# Altium schematic sheet Upconversion.SchDoc: Phaser
size 420 x 297 mm; Author: G.Kasprowicz; CompanyName: WUT ISE; DrawnBy: G.Kasprowicz; Organization: WUT ISE; Address1: PW ISE; Address2: Nowowiejska 15/19 00-665 Warsaw; Address3: gkasprow@gmail.com; DocumentNumber: 9; Revision: 2; SheetNumber: 9; SheetTotal: 18; ModifiedBy: -; CheckedDate: -; Title2: Upconverter; DivGrp: WUT ISE; Designer: G.Kasprowicz; ModifiedDate: -; ProjectName: Sensor Box
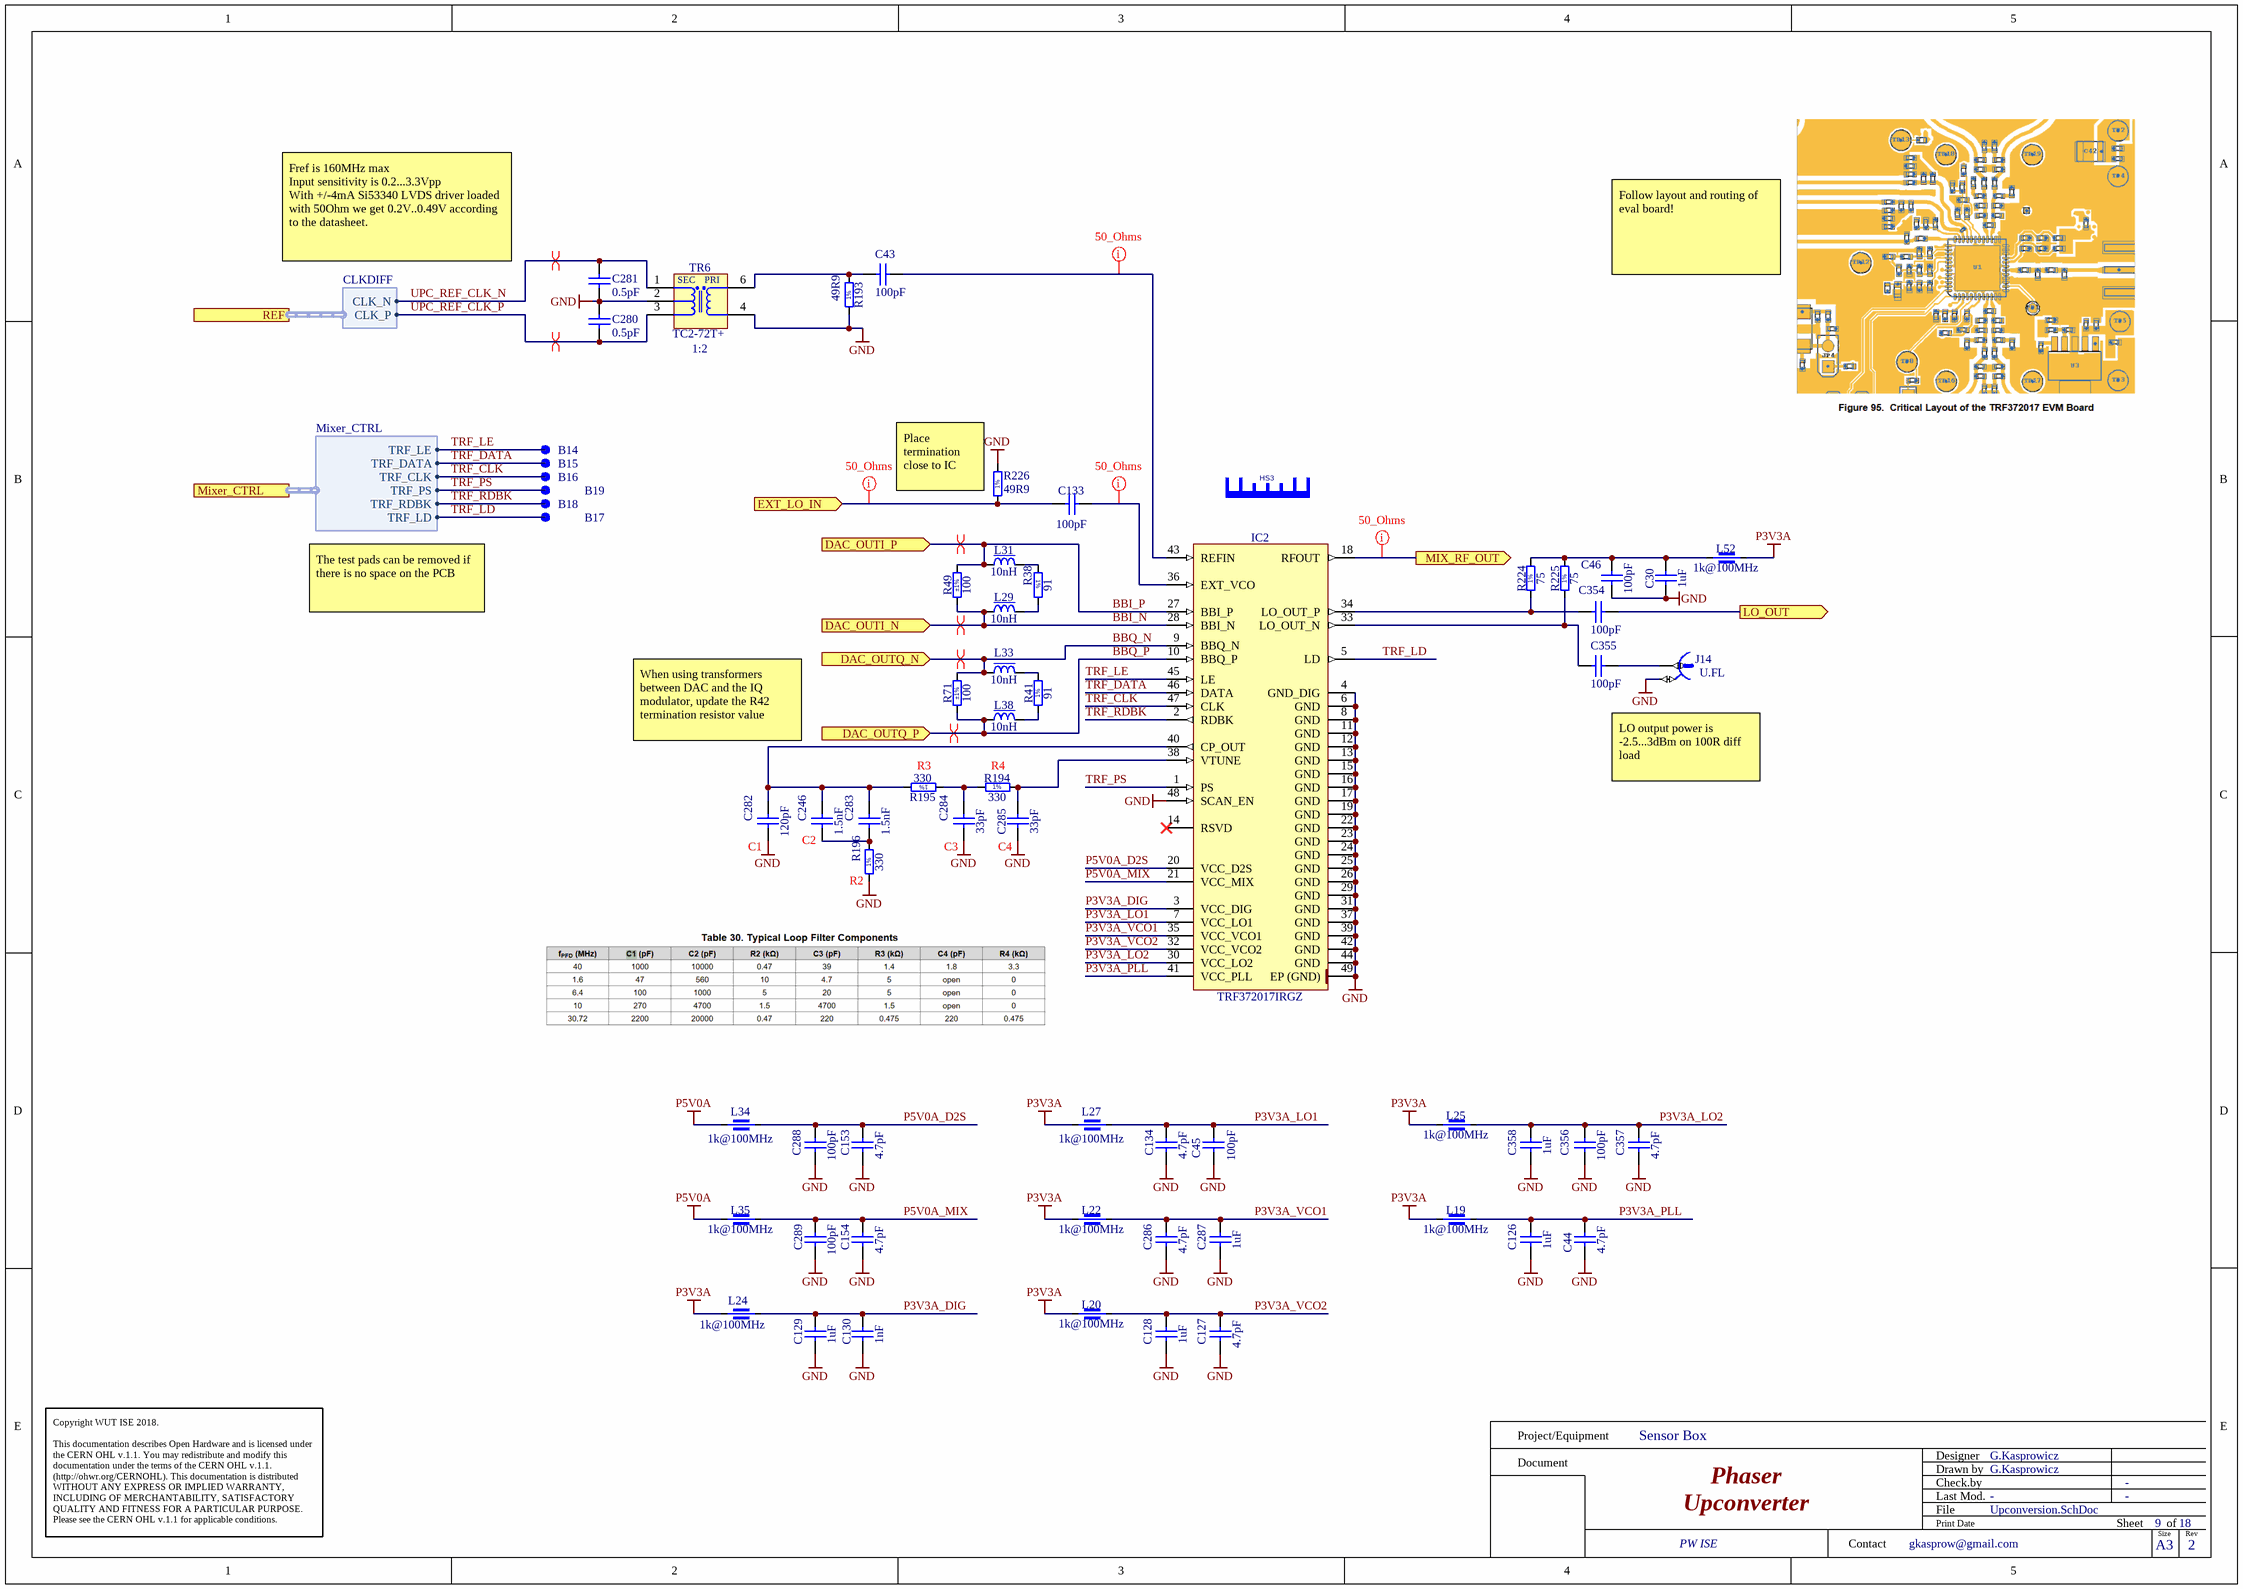
[diagram p0: Upconversion.SchDoc]

## Parts
B14  SMD Pad  [C100]  (value not drawn)
B15  SMD Pad  [C100]  (value not drawn)
B16  SMD Pad  [C100]  (value not drawn)
B17  SMD Pad  [C100]  (value not drawn)
B18  SMD Pad  [C100]  (value not drawn)
B19  SMD Pad  [C100]  (value not drawn)
C30  1uF  [CAPC1005X55N]
C43  100pF  [CAPC1005X55N]
C44  4.7pF  [CAPC1005X55N]
C45  100pF  [CAPC1005X55N]
C46  100pF  [CAPC1005X55N]
C126  1uF  [CAPC1005X55N]
C127  4.7pF  [CAPC1005X55N]
C128  1uF  [CAPC1005X55N]
C129  1uF  [CAPC1005X55N]
C130  1nF  [CAPC1005X55N]
C133  100pF  [CAPC1005X55N]
C134  4.7pF  [CAPC1005X55N]
C153  4.7pF  [CAPC1005X55N]
C154  4.7pF  [CAPC1005X55N]
C246  1.5nF  [CAPC1608X87N]
C280  0.5pF  [CAPC1005X50N]
C281  0.5pF  [CAPC1005X50N]
C282  120pF  [CAPC1608X87N]
C283  1.5nF  [CAPC1608X87N]
C284  33pF  [CAPC2012X135N]
C285  33pF  [CAPC2012X135N]
C286  4.7pF  [CAPC1005X55N]
C287  1uF  [CAPC1005X55N]
C288  100pF  [CAPC1005X55N]
C289  100pF  [CAPC1005X55N]
C354  100pF  [CAPC1005X55N]
C355  100pF  [CAPC1005X55N]
C356  100pF  [CAPC1005X55N]
C357  4.7pF  [CAPC1005X55N]
C358  1uF  [CAPC1005X55N]
HS3  Heat Sink No Pad  [HSINK_17156]  (value not drawn)
IC2  TRF372017IRGZ  [QFN50P700X700X100-49N-S560]
J14  U.FL  [HIROSE_U.FL-R-SMT-1(10)]
L19  1k@100MHz  [INDC1005X55N]
L20  1k@100MHz  [INDC1005X55N]
L22  1k@100MHz  [INDC1005X55N]
L24  1k@100MHz  [INDC1005X55N]
L25  1k@100MHz  [INDC1005X55N]
L27  1k@100MHz  [INDC1005X55N]
L29  10nH  [IND_COILCRAFT_0402DC]
L31  10nH  [IND_COILCRAFT_0402DC]
L33  10nH  [IND_COILCRAFT_0402DC]
L34  1k@100MHz  [INDC1005X55N]
L35  1k@100MHz  [INDC1005X55N]
L38  10nH  [IND_COILCRAFT_0402DC]
L52  1k@100MHz  [INDC1005X55N]
R38  91  [RESC1005X40N]
R41  91  [RESC1005X40N]
R49  100  Tolerance: ±1%  [RESC1005X40N]
R71  100  Tolerance: ±1%  [RESC1005X40N]
R193  49R9  [RESC1005X40N]
R194  330  [RESC1608X55N]
R195  330  [RESC1608X55N]
R196  330  [RESC1608X55N]
R224  75  [RESC1005X40N]
R225  75  [RESC1005X40N]
R226  49R9  [RESC1005X40N]
TR6  1:2  Manufacturer Part Number: TC2-72T+  [XFMR_MINI-CIRCUITS_AT1521]

## Ports
DAC_OUTI_N (in), DAC_OUTI_P (in), DAC_OUTQ_N (in), DAC_OUTQ_P (in), EXT_LO_IN (in), LO_OUT (out), MIX_RF_OUT (out), Mixer_CTRL (harness Mixer_CTRL), REF (harness CLKDIFF)

## Harnesses
CLKDIFF: CLK_N, CLK_P
Mixer_CTRL: TRF_LE, TRF_DATA, TRF_CLK, TRF_PS, TRF_RDBK, TRF_LD

## Nets
GND: C30.1 C44.1 C45.1 C46.1 C126.1 C127.1 C128.1 C129.1 C130.1 C134.1 C153.1 C154.1 C280.1 C281.2 C282.1 C284.1 C285.1 C286.1 C287.1 C288.1 C289.1 C356.1 C357.1 C358.1 IC2.4(GND_DIG) IC2.6(GND) IC2.8(GND) IC2.11(GND) IC2.12(GND) IC2.13(GND) IC2.15(GND) IC2.16(GND) IC2.17(GND) IC2.19(GND) IC2.22(GND) IC2.23(GND) IC2.24(GND) IC2.25(GND) IC2.26(GND) IC2.29(GND) IC2.31(GND) IC2.37(GND) IC2.39(GND) IC2.42(GND) IC2.44(GND) IC2.48(SCAN_EN) IC2.49(EP_(GND)) J14.2 R193.1 R196.1 R226.2 TR6.2(NC) TR6.4(P)
P3V3A: L19.2 L20.2 L22.2 L24.2 L25.2 L27.1 L52.2
P5V0A: L34.1 L35.2
BBI_N: IC2.28(BBI_N) L29.1 R49.1 ; port DAC_OUTI_N
BBI_P: IC2.27(BBI_P) L31.1 R49.2 ; port DAC_OUTI_P
BBQ_N: IC2.9(BBQ_N) L33.1 R71.2 ; port DAC_OUTQ_N
BBQ_P: IC2.10(BBQ_P) L38.1 R71.1 ; port DAC_OUTQ_P
EXT_LO_IN: C133.1 R226.1 ; port EXT_LO_IN
LO_OUT: C354.1 ; port LO_OUT
MIX_RF_OUT: IC2.18(RFOUT) ; port MIX_RF_OUT
P3V3A_DIG: C129.2 C130.2 IC2.3(VCC_DIG) L24.1
P3V3A_LO1: C45.2 C134.2 IC2.7(VCC_LO1) L27.2
P3V3A_LO2: C356.2 C357.2 C358.2 IC2.30(VCC_LO2) L25.1
P3V3A_PLL: C44.2 C126.2 IC2.41(VCC_PLL) L19.1
P3V3A_VCO1: C286.2 C287.2 IC2.35(VCC_VCO1) L22.1
P3V3A_VCO2: C127.2 C128.2 IC2.32(VCC_VCO2) L20.1
P5V0A_D2S: C153.2 C288.2 IC2.20(VCC_D2S) L34.2
P5V0A_MIX: C154.2 C289.2 IC2.21(VCC_MIX) L35.1
TRF_CLK: B16.1 IC2.47(CLK) ; port Mixer_CTRL.TRF_CLK
TRF_DATA: B15.1 IC2.46(DATA) ; port Mixer_CTRL.TRF_DATA
TRF_LD: B17.1 IC2.5(LD) ; port Mixer_CTRL.TRF_LD
TRF_LE: B14.1 IC2.45(LE) ; port Mixer_CTRL.TRF_LE
TRF_PS: B19.1 IC2.1(PS) ; port Mixer_CTRL.TRF_PS
TRF_RDBK: B18.1 IC2.2(RDBK) ; port Mixer_CTRL.TRF_RDBK
UPC_REF_CLK_N: C281.1 TR6.1(SDOT) ; port REF.CLK_N
UPC_REF_CLK_P: C280.2 TR6.3(S) ; port REF.CLK_P
NetC30_2: C30.2 C46.2 L52.1 R224.2 R225.2
NetC43_1: C43.1 R193.2 TR6.6(PDOT)
NetC43_2: C43.2 IC2.43(REFIN)
NetC133_2: C133.2 IC2.36(EXT_VCO)
NetC246_1: C246.1 C283.1 R196.2
NetC246_2: C246.2 C282.2 C283.2 IC2.40(CP_OUT) R195.2
NetC284_2: C284.2 R194.1 R195.1
NetC285_2: C285.2 IC2.38(VTUNE) R194.2
NetC354_2: C354.2 IC2.34(LO_OUT_P) R224.1
NetC355_1: C355.1 J14.1
NetC355_2: C355.2 IC2.33(LO_OUT_N) R225.1
NetL29_2: L29.2 R38.2
NetL31_2: L31.2 R38.1
NetL33_2: L33.2 R41.2
NetL38_2: L38.2 R41.1

Not connected (* = marked no-connect by the designer): IC2 14(RSVD)*

## Layout directives
differential pair; differential pair class Diff_100Ohm: BBI_N, BBI_P, BBQ_N, BBQ_P, UPC_REF_CLK_N, UPC_REF_CLK_P
net class 50_Ohms: EXT_LO_IN, MIX_RF_OUT, NetC43_2, NetC133_2

## Notes on the sheet
- Fref is 160MHz max
  Input sensitivity is 0.2...3.3Vpp
  With +/-4mA Si53340 LVDS driver loaded with 50Ohm we get 0.2V..0.49V according to the datasheet.
- Follow layout and routing of eval board!
- (near R226) Place termination close to IC
- The test pads can be removed if there is no space on the PCB
- When using transformers between DAC and the IQ modulator, update the R42 termination resistor value
- (near R195) R3
- (near R194) R4
- LO output power is -2.5...3dBm on 100R diff load
- (near C282) C1
- (near C246) C2
- (near C284) C3
- (near C285) C4
- (near R196) R2
- Project/Equipment
- Document
- Designer
- Drawn by
- Check.by
- Copyright WUT ISE 2018.
  This documentation describes Open Hardware and is licensed under the CERN OHL v.1.1. You may redistribute and modify this documentation under the terms of the CERN OHL v.1.1. (http://ohwr.org/CERNOHL). This documentation is distributed WITHOUT ANY EXPRESS OR IMPLIED WARRANTY, INCLUDING OF MERCHANTABILITY, SATISFACTORY QUALITY AND FITNESS FOR A PARTICULAR PURPOSE. Please see the CERN OHL v.1.1 for applicable conditions.
- Contact
- File
- Last Mod.
- Print Date
- Sheet
- Size
- A3
- of
- Rev
- (in symbol R0402_49R9_1%_0.0625W_100PPM) 1%
- (in symbol R0402_75R_1%_0.0625W_100PPM) 1%
- (in symbol R0402_91R_1%_0.0625W_100PPM) 1%
- (in symbol R0603_330R_1%_0.1W_100PPM) 1%
- (in symbol XFMR_MINI-CIRCUITS_TC2-72T+) SEC; PRI

## Library data of the parts
B14-B19 = SMD_PAD_D1MM: Through Hole Pad; Part Description: 1mm Diameter SMD Pad; Mounted: No; Part Number: SMD_PAD_D1MM; Component Kind: Standard (No BOM); Component Type: Standard (No BOM); Pin Count: 1; Family: SMD Pad; Socket: No; SMD: No; Sense: No; Status: None; ComponentHeight: 0mm; HelpURL: Undefined; Author: CERN DEM JLC; CreateDate: 10.10.2017; LatestRevisionDate: 10.10.2017; PackageDescription: 1mm Diameter SMD Pad
C30 C126 C128 C129 C287 C358 = CC0402_1UF_16V_10%_X5R: Non-polarised capacitor; Part Description: SMD Multilayer Chip Ceramic Capacitor; Manufacturer: GENERIC; Manufacturer1 Part Number: C1005X5R1C105KT; Voltage: 16V; TC: X5R; Tolerance: ±10%; Part Number: CC0402_1UF_16V_10%_X5R; Component Kind: Standard; Component Type: Standard; Pin Count: 2; Value: 1uF; Status: Preferred; Manufacturer Part Number: CC0402_1UF_16V_10%_X5R; Case: 0402; Mounted: Yes; Socket: No; SMD: Yes; Sense: No; Manufacturer1 Example: TDK; Manufacturer1 ComponentHeight: 0.55mm; HelpURL: \\cern.ch\dfs\Applications\Altium\Datasheets\CC0402_X5R_TDK_C.pdf; Author: CERN DEM JLC; CreateDate: 25.10.2012; LatestRevisionDate: 25.10.2012
C43 C45 C46 C133 C288 C289 C354-C356 = CC0402_100PF_50V_5%_C0G: Non-polarised capacitor; Part Description: SMD Multilayer Chip Ceramic Capacitor; Manufacturer: GENERIC; Manufacturer1 Part Number: C0402C101J5GACTU; Voltage: 50V; TC: C0G/NP0; Tolerance: ±5%; Part Number: CC0402_100PF_50V_5%_C0G; Component Kind: Standard; Component Type: Standard; Pin Count: 2; Value: 100pF; Status: Preferred; Manufacturer Part Number: CC0402_100PF_50V_5%_C0G; Case: 0402; Mounted: Yes; Socket: No; SMD: Yes; Sense: No; Manufacturer1 Example: KEMET; Manufacturer1 ComponentHeight: 0.55mm; HelpURL: \\cern.ch\dfs\Applications\Altium\Datasheets\CC0805_C0G_KEMET_(Commercial Grade).pdf; Author: CERN DEM JLC
  C43 C45 C46 C288 C289 C354-C356: CreateDate: 2007-12-03; LatestRevisionDate: 2015-04-22
  C133: CreateDate: 03.12.2007; LatestRevisionDate: 22.04.2015
C44 C127 C134 C153 C154 C286 C357 = CC0402_4.7PF_50V_0.25PF_C0G: Non-polarised capacitor; Part Description: SMD Multilayer Chip Ceramic Capacitor; Manufacturer: GENERIC; Manufacturer1 Part Number: C0402C479C5GACTU; Voltage: 50V; TC: C0G/NP0; Tolerance: ±0.25pF; Part Number: CC0402_4.7PF_50V_0.25PF_C0G; Component Kind: Standard; Component Type: Standard; Pin Count: 2; Value: 4.7pF; Status: Preferred; Manufacturer Part Number: CC0402_4.7PF_50V_0.25PF_C0G; Case: 0402; Mounted: Yes; Socket: No; SMD: Yes; Sense: No; Manufacturer1 Example: KEMET; Manufacturer1 ComponentHeight: 0.55mm; HelpURL: \\cern.ch\dfs\Applications\Altium\Datasheets\CC0805_C0G_KEMET_(Commercial Grade).pdf; Author: CERN DEM JLC; CreateDate: 03.12.2007; LatestRevisionDate: 22.04.2015
C130 = CC0402_1NF_50V_10%_X7R: Non-polarised capacitor; Part Description: SMD Multilayer Chip Ceramic Capacitor; Manufacturer: GENERIC; Manufacturer1 Part Number: 223858715623; Voltage: 50V; TC: X7R; Tolerance: ±10%; Part Number: CC0402_1NF_50V_10%_X7R; Component Kind: Standard; Component Type: Standard; Pin Count: 2; Value: 1nF; Status: Not Recommended; Manufacturer Part Number: CC0402_1NF_50V_10%_X7R; Case: 0402; Mounted: Yes; Socket: No; SMD: Yes; Sense: No; Manufacturer1 Example: PHYCOMP; Manufacturer1 ComponentHeight: 0.55mm; HelpURL: \\cern.ch\dfs\Applications\Altium\Datasheets\CC0402_X7R_PHYCOMP.pdf; Author: CERN DEM JLC; CreateDate: 03.12.2007; LatestRevisionDate: 03.12.2007
C246 C283 = CC0603_1.5NF_50V_5%_NP0: Non-polarised capacitor; Part Description: SMD Multilayer Chip Ceramic Capacitor; Manufacturer: GENERIC; Manufacturer1 Part Number: GRM1885C1H152JA01D; Voltage: 50V; TC: C0G/NP0; Tolerance: ±5%; Part Number: CC0603_1.5NF_50V_5%_NP0; Component Kind: Standard; Component Type: Standard; Pin Count: 2; Value: 1.5nF; Status: None; Manufacturer Part Number: CC0603_1.5NF_50V_5%_NP0; Case: 0603; Mounted: Yes; Socket: No; SMD: Yes; Sense: No; Manufacturer1 Example: MURATA; Manufacturer1 ComponentHeight: 0.9mm; HelpURL: \\cern.ch\dfs\Applications\Altium\Datasheets\CC0603_NP0_MURATA.pdf; Author: CERN DEM JLC; CreateDate: 08.02.2011; LatestRevisionDate: 08.02.2011
C280 C281 = CC0402_0.5PF_25V_0.05PF_AVX_04023J0R5ABSTR: Non-polarised capacitor; Part Description: Thin-Film Chip Capacitors for RF Signal and Power Applications, Accu-P Series; Manufacturer: AVX; Voltage: 25V; Tolerance: ±0.05pF; Part Number: CC0402_0.5PF_25V_0.05PF_AVX_04023J0R5ABSTR; Component Kind: Standard; Component Type: Standard; Pin Count: 2; Value: 0.5pF; Status: None; Manufacturer Part Number: 04023J0R5ABSTR; Case: 0402; Mounted: Yes; Socket: No; SMD: Yes; Sense: No; ComponentHeight: 0.5mm; HelpURL: \\cern.ch\dfs\Applications\Altium\Datasheets\CC0402_AVX_ACCU-P.pdf; Author: CERN DEM JLC; CreateDate: 2017-02-22; LatestRevisionDate: 2017-02-22
C282 = CC0603_120PF_50V_5%_NP0: Non-polarised capacitor; Part Description: SMD Multilayer Chip Ceramic Capacitor; Manufacturer: GENERIC; Manufacturer1 Part Number: 223886715121; Voltage: 50V; TC: C0G/NP0; Tolerance: ±5%; Part Number: CC0603_120PF_50V_5%_NP0; Component Kind: Standard; Component Type: Standard; Pin Count: 2; Value: 120pF; Status: Preferred; Manufacturer Part Number: CC0603_120PF_50V_5%_NP0; Case: 0603; Mounted: Yes; Socket: No; SMD: Yes; Sense: No; Manufacturer1 Example: PHYCOMP; Manufacturer1 ComponentHeight: 0.87mm; HelpURL: \\cern.ch\dfs\Applications\Altium\Datasheets\CC0603_NP0_PHYCOMP.pdf; Author: CERN DEM JLC; CreateDate: 03.12.2007; LatestRevisionDate: 03.12.2007
C284 C285 = CC0805_33pF_50V_5%_NP0: Non-polarised capacitor; Part Description: SMD Multilayer Chip Ceramic Capacitor; Manufacturer: GENERIC; Manufacturer1 Part Number: 223886115339; Voltage: 50V; TC: C0G/NP0; Tolerance: ±5%; Part Number: CC0805_33PF_50V_5%_NP0; Component Kind: Standard; Component Type: Standard; Pin Count: 2; Value: 33pF; Status: Preferred; Manufacturer Part Number: CC0805_33PF_50V_5%_NP0; Case: 0805; Mounted: Yes; Socket: No; SMD: Yes; Sense: No; Manufacturer1 Example: PHYCOMP; Manufacturer1 ComponentHeight: 1.35mm; HelpURL: \\cern.ch\dfs\Applications\Altium\Datasheets\CC0805_NP0_PHYCOMP.pdf; Author: CERN DEM JLC; CreateDate: 03.12.2007; LatestRevisionDate: 03.12.2007
HS3 = HEAT_SINK_IC_7x7x15: Alphacool GPU RAM Aluminium Heatsinks 7x7mm - black; Part Number: 4250197171564; Manufacturer Part Number: 17156; PressFit: No; Component Kind: Accessories; Component Type: Standard; Pin Count: 0; PackageDescription: Alphacool GPU RAM Aluminium Heatsinks 7x7mm - black; Mounted: Yes; Socket: No; SMD: No; Sense: No; Status: None; Part Description: Alphacool GPU RAM Aluminium Heatsinks 7x7mm; Manufacturer: Alphacool; ComponentHeight: 18; HelpURL: \\cern.ch\dfs\Applications\Altium\Datasheets\HSINK_FISCHER_ICK SMD A 13 SA.pdf; Author: GK; CreateDate: 28.05.2015; LatestRevisionDate: 28.05.2015
IC2 = TRF372017IRGZ: Integrated IQ Modulator PLL/VCO; Manufacturer: TEXAS INSTRUMENTS; PressFit: No; Bonding: No; Part Number: TRF372017IRGZ; Component Kind: Standard; Component Type: Standard; Device: TRF372017IRGZ; PackageDescription: QFN, 0.50mm Pitch, Square; 48 Pin, 7.00mm L X 7.00mm W X 1.00mm H body (W/Thermal Tab 5.6mm X 5.6mm), IPC Medium Density; Part Description: Integrated IQ Modulator PLL/VCO; Manufacturer Part Number: TRF372017IRGZ; Pin Count: 49; Case: QFN48; Mounted: Yes; Socket: No; SMD: Yes; Sense: No; ComponentHeight: 1mm; Author: CERN DEM JMW; HelpURL: \\cern.ch\dfs\Applications\Altium\Datasheets\TRF372017IRGZ.pdf; CreateDate: 2019-11-29; LatestRevisionDate: 2019-11-29
J14 = HIROSE_U.FL-R-SMT-1(10): Part Description: Up to 6GHz Ultra Small Surface Mount Male Coaxial Connectors U.FL Series; Manufacturer: HIROSE (HRS); PressFit: No; Component Kind: Standard; Component Type: Standard; Pin Count: 2; Mounted: Yes; Socket: No; Sense: No; SMD: Yes; Status: None; Manufacturer Part Number: U.FL-R-SMT-1(10); ComponentHeight: 1.25mm; HelpURL: \\cern.ch\dfs\Applications\Altium\Datasheets\HIROSE_U.FL-R-SMT-1(10).pdf; Author: CERN DEM JLC; CreateDate: 24.03.2010; LatestRevisionDate: 24.03.2010; Part Number: HIROSE_U.FL-R-SMT-1(10); Family: U.FL
L19 L20 L22 L24 L25 L27 L34 L35 L52 = IND0402_MURATA_BLM15HD102SN1: Part Description: SMD EMIFIL Suppression Chip Ferrite Bead; Manufacturer: MURATA; Manufacturer Part Number: BLM15HD102SN1D; Power: 250mA; Resistance: 1.25R; Tolerance: ±25%; Part Number: IND0402_MURATA_BLM15HD102SN1; Component Kind: Standard; Component Type: Standard; Pin Count: 2; Value: 1k@100MHz; Status: None; Case: 0402; Mounted: Yes; Socket: No; SMD: Yes; Sense: No; ComponentHeight: 0.55mm; HelpURL: \\cern.ch\dfs\Applications\Altium\Datasheets\IND0402_MURATA_BLM15H.pdf; Author: CERN DEM JLC; CreateDate: 06.03.2012; LatestRevisionDate: 25.10.2018
L29 L31 L33 L38 = IND0402_10NH_2%_COILCRAFT_0402DC: Inductor With Core; Part Description: Ceramic Wirewound Chip Inductor, 0402DC Series; Manufacturer Part Number: 0402DC-10NXGRW; Power: 1A; Resistance: 0.073R; Tolerance: ±2%; Part Number: IND0402_10NH_2%_COILCRAFT_0402DC; Component Kind: Standard; Component Type: Standard; Pin Count: 2; Value: 10nH; Status: None; Manufacturer: COILCRAFT; Case: 0402; Mounted: Yes; Socket: No; SMD: Yes; Sense: No; ComponentHeight: 0.61mm; HelpURL: \\cern.ch\dfs\Applications\Altium\Datasheets\IND0402_COILCRAFT_0402DC.pdf; Author: GK; CreateDate: 04.12.2018; LatestRevisionDate: 04.12.2018
R38 R41 = R0402_91R_1%_0.0625W_100PPM: Resistor - 1%; Part Description: General Purpose Thick Film Chip Resistor; Manufacturer: GENERIC; Manufacturer1 Part Number: 232270679109L; TC: ±100ppm/°C; PressFit: No; Part Number: R0402_91R_1%_0.0625W_100PPM; Component Kind: Standard; Component Type: Standard; Pin Count: 2; Value: 91; Status: Not Recommended; Power: 0.0625W; Tolerance: ±1%; Manufacturer Part Number: R0402_91R_1%_0.0625W_100PPM; Case: 0402; Mounted: Yes; Sense: No; Socket: No; SMD: Yes; Manufacturer1 Example: YAGEO PHYCOMP; Manufacturer1 ComponentHeight: 0.4mm; HelpURL: \\cern.ch\dfs\Applications\Altium\Datasheets\R0402_Phycomp_RC0402.pdf; Author: CERN DEM JLC; CreateDate: 03.12.2007; LatestRevisionDate: 17.10.2012
R49 R71 = R0402_100R_1%_0.0625W_100PPM: Resistor - 1%; Part Description: General Purpose Thick Film Chip Resistor; Manufacturer: GENERIC; Manufacturer1 Part Number: 232270671001L; TC: ±100ppm/°C; PressFit: No; Part Number: R0402_100R_1%_0.0625W_100PPM; Component Kind: Standard; Component Type: Standard; Pin Count: 2; Value: 100; Status: Not Recommended; Power: 0.0625W; Manufacturer Part Number: R0402_100R_1%_0.0625W_100PPM; Case: 0402; Mounted: Yes; Sense: No; Socket: No; SMD: Yes; Manufacturer1 Example: YAGEO PHYCOMP; Manufacturer1 ComponentHeight: 0.4mm; HelpURL: \\cern.ch\dfs\Applications\Altium\Datasheets\R0402_Phycomp_RC0402.pdf; Author: CERN DEM JLC; CreateDate: 03.12.2007; LatestRevisionDate: 17.10.2012
R193 R226 = R0402_49R9_1%_0.0625W_100PPM: Resistor - 1%; Part Description: General Purpose Thick Film Chip Resistor; Manufacturer: GENERIC; Manufacturer1 Part Number: 232270674999L or RC0402FR-0749R9L; TC: ±100ppm/°C; PressFit: No; Part Number: R0402_49R9_1%_0.0625W_100PPM; Component Kind: Standard; Component Type: Standard; Pin Count: 2; Value: 49R9; Status: Not Recommended; Power: 0.0625W; Tolerance: ±1%; Manufacturer Part Number: R0402_49R9_1%_0.0625W_100PPM; Case: 0402; Mounted: Yes; Sense: No; Socket: No; SMD: Yes; Manufacturer1 Example: YAGEO PHYCOMP; Manufacturer1 ComponentHeight: 0.4mm; HelpURL: \\cern.ch\dfs\Applications\Altium\Datasheets\R0402_Phycomp_RC0402.pdf; Author: CERN DEM JLC; CreateDate: 24.10.2012; LatestRevisionDate: 24.10.2012
R194 = R0603_330R_1%_0.1W_100PPM: Resistor - 1%; Part Description: General Purpose Thick Film Chip Resistor; Manufacturer: GENERIC; Manufacturer1 Part Number: NRC06F3300TRF; PressFit: No; Power: 0.1W; TC: ±100ppm/°C; Part Number: R0603_330R_1%_0.1W_100PPM; Component Kind: Standard; Component Type: Standard; Pin Count: 2; Value: 330; Status: Preferred; Manufacturer Part Number: R0603_330R_1%_0.1W_100PPM; Case: 0603; Mounted: Yes; Sense: No; Socket: No; SMD: Yes; Manufacturer1 Example: NIC COMPONENT; Manufacturer1 ComponentHeight: 0.55mm; HelpURL: \\cern.ch\dfs\Applications\Altium\Datasheets\R0603_NIC_NRC.pdf; Author: CERN DEM JLC; CreateDate: 03.12.2007; LatestRevisionDate: 13.03.2008; Tolerance: ±1%
R195 R196 = R0603_330R_1%_0.1W_100PPM: Resistor - 1%; Part Description: General Purpose Thick Film Chip Resistor; Manufacturer: GENERIC; Manufacturer1 Part Number: NRC06F3300TRF; Power: 0.1W; TC: ±100ppm/°C; PressFit: No; Part Number: R0603_330R_1%_0.1W_100PPM; Component Kind: Standard; Component Type: Standard; Pin Count: 2; Value: 330; Status: Preferred; Tolerance: ±1%; Manufacturer Part Number: R0603_330R_1%_0.1W_100PPM; Case: 0603; Mounted: Yes; Sense: No; Socket: No; SMD: Yes; Manufacturer1 Example: NIC COMPONENT; Manufacturer1 ComponentHeight: 0.55mm; HelpURL: \\cern.ch\dfs\Applications\Altium\Datasheets\R0603_NIC_NRC.pdf; Author: CERN DEM JLC; CreateDate: 03.12.2007; LatestRevisionDate: 13.03.2008
R224 R225 = R0402_75R_1%_0.0625W_100PPM: Resistor - 1%; Part Description: General Purpose Thick Film Chip Resistor; Manufacturer: GENERIC; Manufacturer1 Part Number: 232270677509L; TC: ±100ppm/°C; PressFit: No; Part Number: R0402_75R_1%_0.0625W_100PPM; Component Kind: Standard; Component Type: Standard; Pin Count: 2; Value: 75; Status: Not Recommended; Power: 0.0625W; Tolerance: ±1%; Manufacturer Part Number: R0402_75R_1%_0.0625W_100PPM; Case: 0402; Mounted: Yes; Sense: No; Socket: No; SMD: Yes; Manufacturer1 Example: YAGEO PHYCOMP; Manufacturer1 ComponentHeight: 0.4mm; HelpURL: \\cern.ch\dfs\Applications\Altium\Datasheets\R0402_Phycomp_RC0402.pdf; Author: CERN DEM JLC; CreateDate: 03.12.2007; LatestRevisionDate: 17.10.2012
TR6 = XFMR_MINI-CIRCUITS_TC2-72T+: 50 Ohms 10 to 700 MHzz RF Transformer; Part Description: 50 Ohms 10 to 700MHz RF Transformer; Manufacturer: MINI-CIRCUITS; HelpURL: \\cern.ch\dfs\Applications\Altium\Datasheets\XFMR_MINI-CIRCUITS_TC2-1TX+.pdf; Part Number: XFMR_MINI-CIRCUITS_TC2-72T+; Component Kind: Standard; Component Type: Standard; Pin Count: 5; Value: 1:2; Status: None; Mounted: Yes; Socket: No; Sense: No; SMD: Yes; ComponentHeight: 4.06mm; Author: GK; CreateDate: 18.10.2019; LatestRevisionDate: 18.10.2019